# EAGLE design Eval (EAGLE 9.6.2)
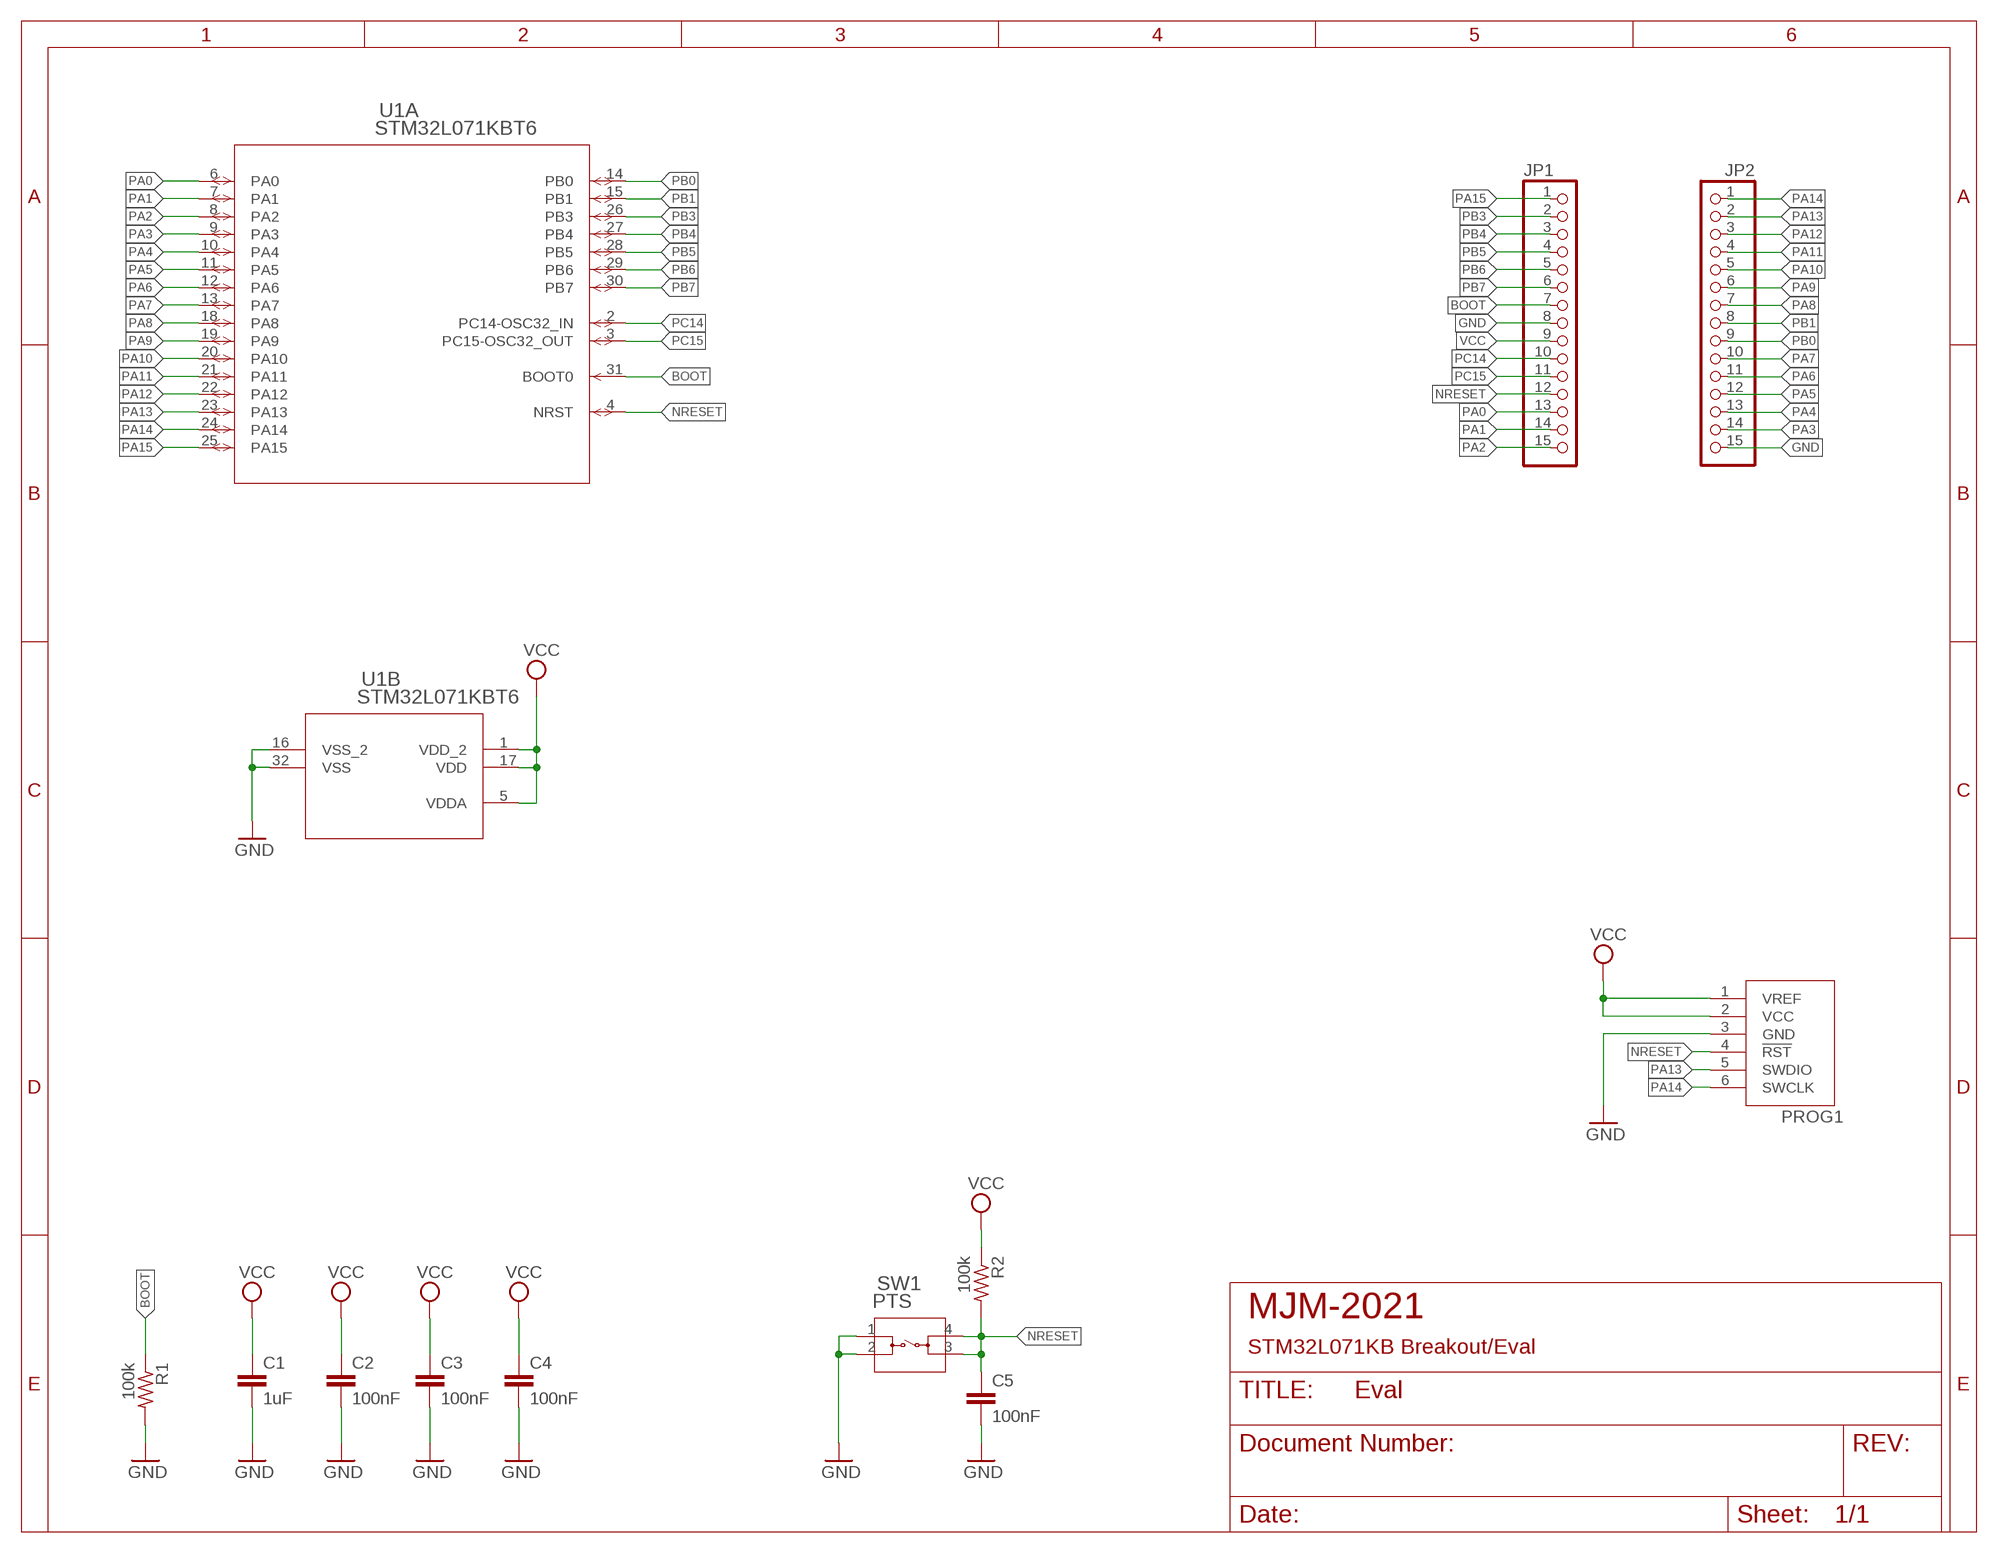
[diagram p0: schematic, sheet 1]

## Parts
C1  1uF  C-EUC0603  [C0603]
C2  100nF  C-EUC0603  [C0603]
C3  100nF  C-EUC0603  [C0603]
C4  100nF  C-EUC0603  [C0603]
C5  100nF  C-EUC0603  [C0603]
JP1  PINHD-1X15  [1X15]
JP2  PINHD-1X15  [1X15]
PROG1  0532610671  [0532610671]
R1  100k  R-US_R0603  [R0603]
R2  100k  R-US_R0603  [R0603]
SW1  PTS  PTS_647_SN50_SMTR2_LFSPTS_647_SN50_SMTR2_LFS-M  [PTS_647_SN50_SMTR2_LFS-M]
U1  STM32L071KBT6  [LQFP32_7X7X1P4]

## Nets
BOOT: JP1.7 R1.1 U1.31(A:BOOT0)
GND: C1.2 C2.2 C3.2 C4.2 C5.2 JP1.8 JP2.15 PROG1.3(GND) R1.2 SW1.1 SW1.2 U1.16(B:VSS_2) U1.32(B:VSS)
NRESET: C5.1 JP1.12 PROG1.4(!RST) R2.2 SW1.3 SW1.4 U1.4(A:NRST)
PA0: JP1.13 U1.6(A:PA0)
PA1: JP1.14 U1.7(A:PA1)
PA2: JP1.15 U1.8(A:PA2)
PA3: JP2.14 U1.9(A:PA3)
PA4: JP2.13 U1.10(A:PA4)
PA5: JP2.12 U1.11(A:PA5)
PA6: JP2.11 U1.12(A:PA6)
PA7: JP2.10 U1.13(A:PA7)
PA8: JP2.7 U1.18(A:PA8)
PA9: JP2.6 U1.19(A:PA9)
PA10: JP2.5 U1.20(A:PA10)
PA11: JP2.4 U1.21(A:PA11)
PA12: JP2.3 U1.22(A:PA12)
PA13: JP2.2 PROG1.5(SWDIO) U1.23(A:PA13)
PA14: JP2.1 PROG1.6(SWCLK) U1.24(A:PA14)
PA15: JP1.1 U1.25(A:PA15)
PB0: JP2.9 U1.14(A:PB0)
PB1: JP2.8 U1.15(A:PB1)
PB3: JP1.2 U1.26(A:PB3)
PB4: JP1.3 U1.27(A:PB4)
PB5: JP1.4 U1.28(A:PB5)
PB6: JP1.5 U1.29(A:PB6)
PB7: JP1.6 U1.30(A:PB7)
PC14: JP1.10 U1.2(A:PC14-OSC32_IN)
PC15: JP1.11 U1.3(A:PC15-OSC32_OUT)
VCC: C1.1 C2.1 C3.1 C4.1 JP1.9 PROG1.1(VREF) PROG1.2(VCC) R2.1 U1.1(B:VDD_2) U1.5(B:VDDA) U1.17(B:VDD)

## Notes on the sheet
- MJM-2021
- STM32L071KB Breakout/Eval

## Library data of the parts
C1-C5 = rcl:C-EU: CAPACITOR, European symbol; SPICEPREFIX: C
JP1 JP2 = pinhead:PINHD-1X15: PIN HEADER
PROG1 = 0532610671:0532610671
R1 R2 = rcl:R-US_: RESISTOR, American symbol; SPICEPREFIX: R
SW1 = PTS-647-SN50-SMTR2-LFS:PTS_647_SN50_SMTR2_LFS; BUILT_BY: EMA_Cory; COPYRIGHT: Copyright (C) 2018 Accelerated Designs. All rights reserved; DATASHEET: https://dznh3ojzb2azq.cloudfront.net/products/Tactile/PTS647/documents/datasheet.pdf; MANUFACTURER_PART_NUMBER: PTS 647 SN50 SMTR2 LFS; SOURCELIBRARY: C&K_2020-03-06; VENDOR: C&K
U1 = STM32L071KBT6:STM32L071KBT6; BUILT_BY: EMA_UL_Team; COPYRIGHT: Copyright (C) 2018 Accelerated Designs. All rights reserved; MANUFACTURER_PART_NUMBER: STM32L071KBT6; SOURCELIBRARY: Updates_to_database_2020-10-19; VENDOR: STMicroelectronics

## Board
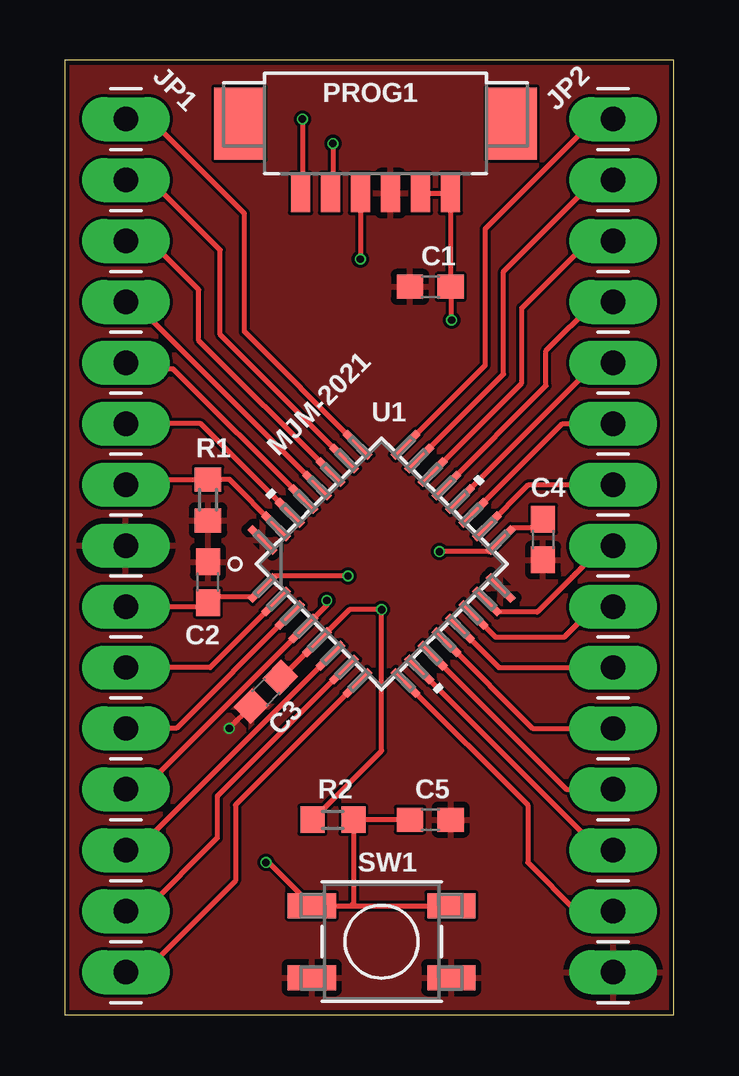
[diagram p1: board, top side]
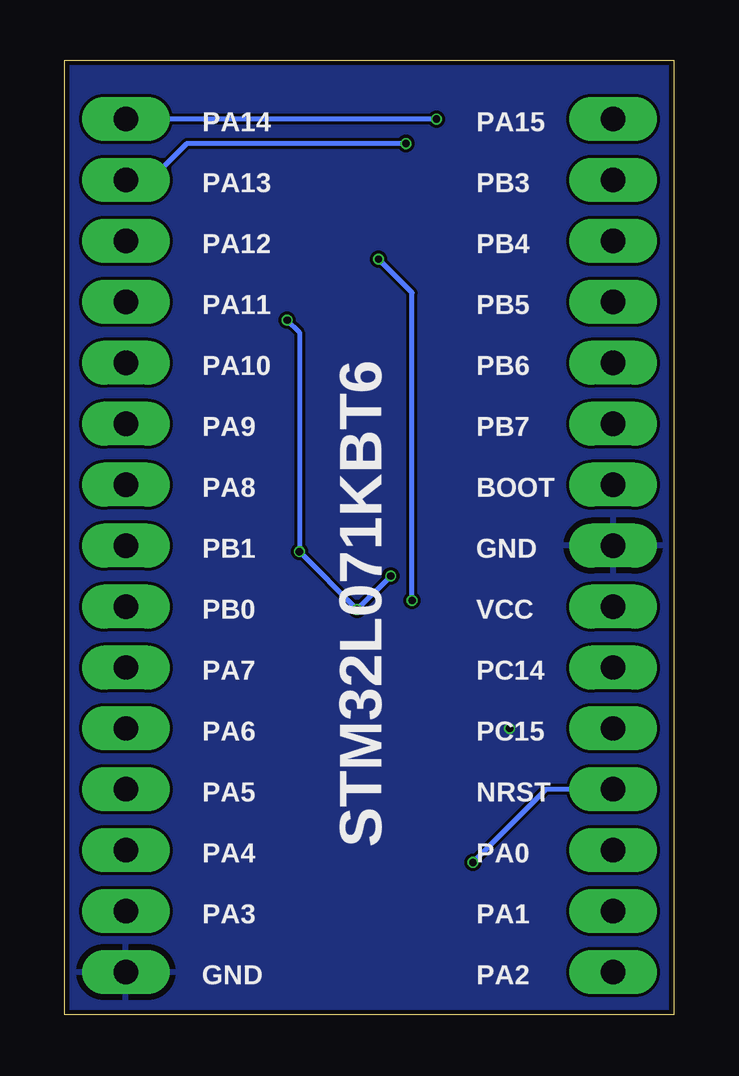
[diagram p2: board, bottom side, seen from below]

Size 25.4 x 39.8 mm. Coordinates in mm from the lower left corner, seen from the top.
Outline: 0,0 25.4,0 25.4,39.8 0,39.8 0,0
Copper layers (1*16): Top 0.035mm / dielectric 1.6mm / Bottom 0.035mm
Design rules "jlcpcb-2layers_tinted_vias": minimum track width 5mil, minimum drill 0.3mm, track to track 5mil, track to pad 5mil, pad to pad 5mil, via to via 5mil, smd to smd 5mil, copper to edge 0.2mm, drill to drill 6mil, minimum pad ring 10mil, minimum via ring 3mil, stop-mask expansion 4mil, vias tented up to drill 20mil, thermal gap 10mil

### Footprints (pad centres in the part's own frame; a part is rotated, then mirrored left to right if it is on the bottom)
C0603 = smd 1.1 x 1: 1 -0.85,0; 2 0.85,0
1X15 = drill 1.016 long: 1 -17.78,0; 2 -15.24,0; 3 -12.7,0; 4 -10.16,0; 5 -7.62,0; 6 -5.08,0; 7 -2.54,0; 8 0,0; 9 2.54,0; 10 5.08,0; 11 7.62,0; 12 10.16,0; 13 12.7,0; 14 15.24,0; 15 17.78,0
0532610671 = smd 0.8 x 1.6: 1 -3.125,0.8; 2 -1.875,0.8; 3 -0.625,0.8; 4 0.625,0.8; 5 1.875,0.8; 6 3.125,0.8 | smd 2.1 x 3: 7 -5.675,-2.1; 8 5.67,-2.1
R0603 = smd 1 x 1.1: 1 -0.85,0; 2 0.85,0
PTS_647_SN50_SMTR2_LFS-M = smd 2.007 x 1.041: 1 -2.908,1.5; 2 2.908,1.5; 3 -2.908,-1.5; 4 2.908,-1.5
LQFP32_7X7X1P4 = smd 1.473 x 0.305: 1 -4.216,2.8; 2 -4.216,2; 3 -4.216,1.2; 4 -4.216,0.4; 5 -4.216,-0.4; 6 -4.216,-1.2; 7 -4.216,-2; 8 -4.216,-2.8; 17 4.216,-2.8; 18 4.216,-2; 19 4.216,-1.2; 20 4.216,-0.4; 21 4.216,0.4; 22 4.216,1.2; 23 4.216,2; 24 4.216,2.8 | smd 0.305 x 1.473: 9 -2.8,-4.216; 10 -2,-4.216; 11 -1.2,-4.216; 12 -0.4,-4.216; 13 0.4,-4.216; 14 1.2,-4.216; 15 2,-4.216; 16 2.8,-4.216; 25 2.8,4.216; 26 2,4.216; 27 1.2,4.216; 28 0.4,4.216; 29 -0.4,4.216; 30 -1.2,4.216; 31 -2,4.216; 32 -2.8,4.216

### Placement (x,y rotation side)
C1  15.24,30.35 180 top
C2  5.97,18.03 90 top
C3  8.38,13.46 225 top
C4  19.94,19.81 270 top
C5  15.24,8.13 0 top
JP1  2.54,19.56 270 top
JP2  22.86,19.56 270 top
PROG1  12.95,35.05 180 top
R1  5.97,21.46 270 top
R2  11.18,8.13 0 top
SW1  13.21,3.05 180 top
U1  13.21,18.8 45 top

### Tracks (layer width: path | path; a pad name or v marks a point on that pad's centre or on a via)
BOOT
  Top 0.203: U1.31 6.86,22.31 R1.1 2.75,22.31 JP1.7
GND  (via drill 0.3)
  Top 0.203: C3.2 v6.86,11.94
  pour Top: -0.51,40.13 25.91,40.13 25.91,-0.51 -0.51,-0.51
  pour Bottom: -0.51,40.13 25.91,40.13 25.91,-0.51 -0.51,-0.51
NRESET  (via drill 0.3)
  Top 0.203: 11.94,4.55 SW1.4 8.5,6.35 v8.38,6.35 | 11.94,4.55 SW1.3 | 11.94,4.55 12.03,4.64 R2.2 C5.1 | v10.92,17.27 10.92,17.08 U1.4 3.24,9.4 JP1.12 | PROG1.4 v12.33,31.51 v12.32,31.5
  Bottom 0.203: JP1.12 5.33,9.4 v8.38,6.35 | v10.92,17.27 10.92,30.1 v12.32,31.5
PA0
  Top 0.203: U1.6 2.97,6.86 JP1.13
PA1
  Top 0.203: U1.7 6.35,9.11 6.35,7.37 3.3,4.32 JP1.14
PA2
  Top 0.203: U1.8 7.11,8.74 7.11,5.59 3.3,1.78 JP1.15
PA3
  Top 0.203: U1.9 19.3,8.74 19.3,6.35 21.34,4.32 JP2.14
PA4
  Top 0.203: U1.10 22.32,6.86 JP2.13
PA5
  Top 0.203: U1.11 20.91,9.4 JP2.12
PA6
  Top 0.203: U1.12 19.5,11.94 JP2.11
PA7
  Top 0.203: U1.13 18.09,14.48 JP2.10
PA8
  Top 0.203: U1.18 19.34,22.1 JP2.7
PA9
  Top 0.203: U1.19 20.75,24.64 JP2.6
PA10
  Top 0.203: U1.20 22.16,27.18 JP2.5
PA11
  Top 0.203: U1.21 20.07,26.22 20.07,27.69 22.1,29.72 JP2.4
PA12
  Top 0.203: U1.22 19.05,26.34 19.05,29.46 21.84,32.26 JP2.3
PA13  (via drill 0.3)
  Top 0.203: U1.23 18.29,26.7 18.29,30.99 22.1,34.8 JP2.2 | v11.18,36.32 11.18,34.35 PROG1.5
  Bottom 0.203: v11.18,36.32 20.32,36.32 21.84,34.8 JP2.2
PA14  (via drill 0.3)
  Top 0.203: U1.24 17.53,27.07 17.53,32.77 22.1,37.34 JP2.1 | v9.91,37.34 9.91,34.33 PROG1.6
  Bottom 0.203: v9.91,37.34 JP2.1
PA15
  Top 0.203: U1.25 7.49,28.47 7.49,33.4 3.56,37.34 JP1.1
PB0
  Top 0.203: U1.14 17.95,15.75 20.83,15.75 22.1,17.02 JP2.9
PB1
  Top 0.203: U1.15 18.05,16.78 19.7,16.78 22.48,19.56 JP2.8
PB3
  Top 0.203: U1.26 6.48,28.36 6.48,31.88 3.56,34.8 JP1.2
PB4
  Top 0.203: U1.27 5.59,28.11 5.59,30.23 3.56,32.26 JP1.3
PB5
  Top 0.203: U1.28 3.05,29.52 3.05,29.46 2.79,29.72 JP1.4
PB6
  Top 0.203: U1.29 4.51,26.92 2.79,26.92 JP1.5
PB7
  Top 0.203: U1.30 5.67,24.64 JP1.6
PC14
  Top 0.203: U1.2 6.06,14.48 JP1.10
PC15
  Top 0.203: U1.3 4.65,11.94 JP1.11
VCC  (via drill 0.3)
  Top 0.203: C4.1 19.56,20.28 18.65,20.28 U1.17 17.68,19.3 v15.62,19.3 | v11.81,18.29 8.74,18.29 U1.1 7.87,17.41 6.2,17.41 C2.1 5.8,17.02 JP1.9 | PROG1.2 PROG1.1 16.08,30.36 C1.1 16.09,29 v16.13,28.96 | C3.1 9.04,14.06 U1.5 11.87,16.89 v13.21,16.89 13.21,11.01 R2.1
  Bottom 0.203: v16.13,28.96 15.62,28.45 v15.62,19.3 v13.21,16.89 v11.81,18.29

### Text on the board
tPlace: MJM-2021
bPlace: PA15 | PA14 | PB3 | PA13 | PB4 | PA12 | PB5 | PA11 | PB6 | STM32L071KBT6 | PA10 | PB7 | PA9 | BOOT | PA8 | GND | PB1 | VCC | PB0 | PC14 | PA7 | PC15 | PA6 | NRST | PA5 | PA0 | PA4 | PA1 | PA3 | PA2 | GND